# Altium schematic sheet CAN_Trcv.SchDoc
size Letter; SheetNumber: 7; SheetTotal: 8
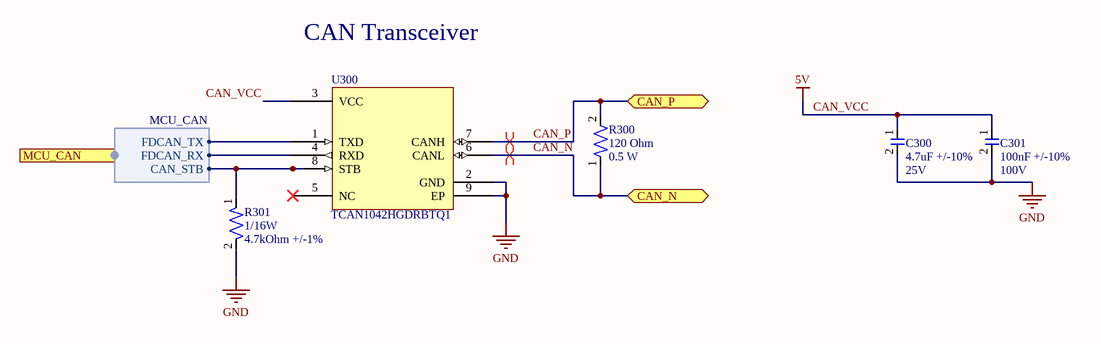
[diagram p0: CAN_Trcv.SchDoc]

## Parts
C300  Capacitance: 4.7uF +/-10%  Voltage Rating: 25V  [CAP-0603]  (hidden comment: TMK107BBJ475KA-T)
C301  Capacitance: 100nF +/-10%  Voltage Rating: 100V  [CAP-0603]  (hidden comment: CC0603KRX7R0BB104)
R300  Resistance: 120 Ohm  Power: 0.5 W  [RES-1206]  (hidden comment: CRGH1206F120R)
R301  Power Rating: 1/16W  Resistance: 4.7kOhm +/-1%  [RES-0402]  (hidden comment: RC0402FR-074K7P)
U300  TCAN1042HGDRBTQ1  [IC-8-VSON]

## Ports
CAN_N (bidir), CAN_P (bidir), MCU_CAN (harness MCU_CAN)

## Harnesses
MCU_CAN: FDCAN_TX, FDCAN_RX, CAN_STB

## Nets
CAN_VCC: C300.1 C301.1 U300.3(VCC)  [also labelled 5V]
GND: C300.2 C301.2 R301.2 U300.2(GND) U300.9(EP)
CAN_N: R300.1 U300.6(CANL) ; port CAN_N
CAN_P: R300.2 U300.7(CANH) ; port CAN_P
NetR301_1: R301.1 U300.8(STB) ; port MCU_CAN.CAN_STB
NetU300_1: U300.1(TXD) ; port MCU_CAN.FDCAN_TX
NetU300_4: U300.4(RXD) ; port MCU_CAN.FDCAN_RX

Not connected (* = marked no-connect by the designer): U300 5(NC)*

## Layout directives
differential pair: CAN_N, CAN_P

## Notes on the sheet
- CAN Transceiver

## Library data of the parts
C300 = CAP-4.7U-0001: 4.7 µF ±10% 25V Ceramic Capacitor X5R 0603 (1608 Metric); Manufacturer: Taiyo Yuden; Assembled?: no; Manufacturer Part Number: TMK107BBJ475KA-T; Temperature Coefficient: X5R; Package Size: 0603
C301 = CAP-100N-0001: CAP CER 0.1UF 100V X7R 0603; Manufacturer: YAGEO; Assembled?: no; Manufacturer Part Number: CC0603KRX7R0BB104; Temperature Coefficient: X7R; Package Size: 0603
R300 = RES-120-0002: 120 Ohms ±1% 0.5W, 1/2W Chip Resistor 1206 (3216 Metric) Thick Film; Tolerance: 1%; Package Size: 1206
R301 = RES-4.7K-0001: RES SMD 4.7K OHM 1% 1/16W 0402; Manufacturer: YAGEO; Assembled?: no; Manufacturer Part Number: RC0402FR-074K7P; Package Size: 0402
U300 = IC-CAN-TRANSCEIVER-0002: 1/1 Transceiver CANbus 8-VSON (3x3); Manufacturer: Texas Instrument; CAN Capability: FD-CAN; Manufacturer Part Number: TCAN1042HGDRBTQ1